# EAGLE design TVC-NanoSD-IO-2-1 (EAGLE 8.3.1)
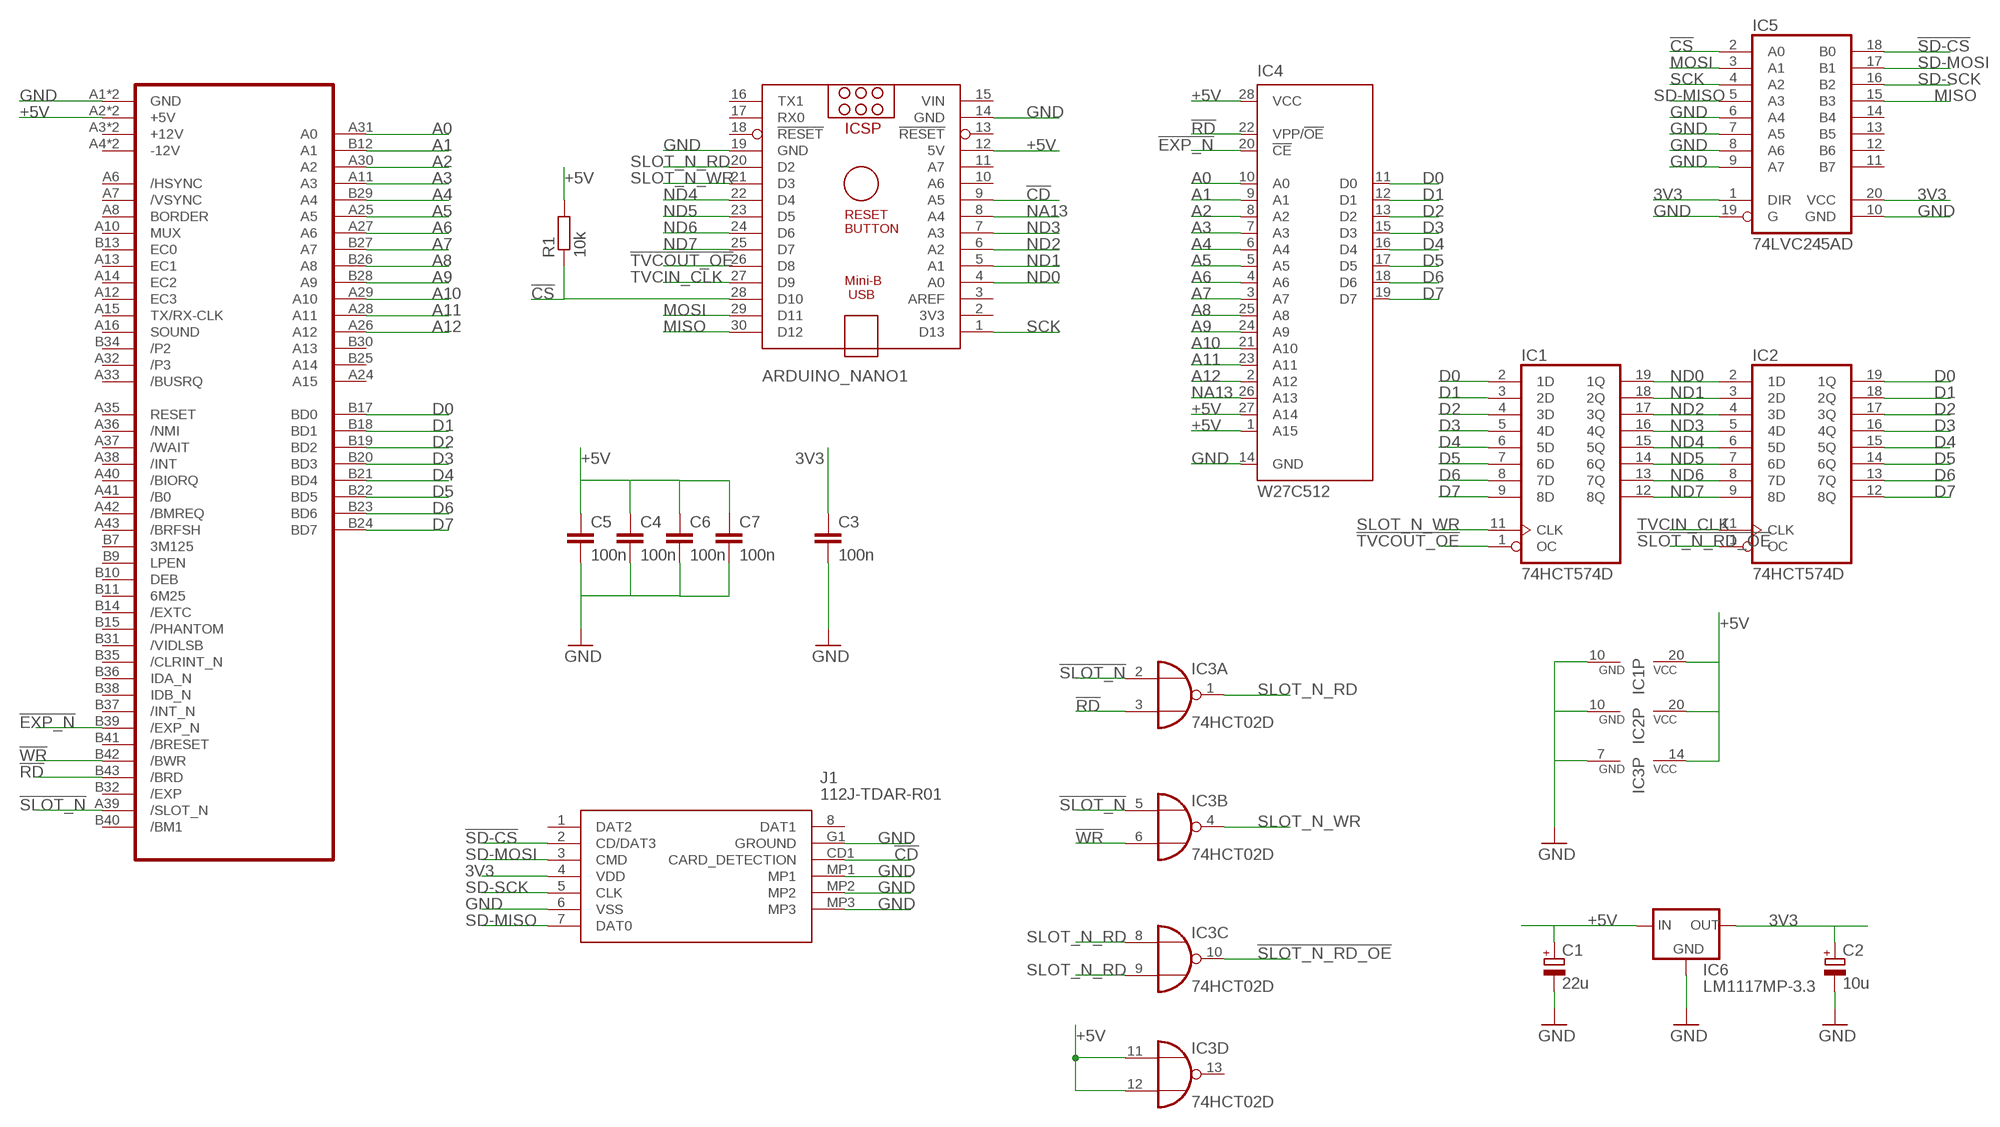
[diagram p0: schematic, sheet 1]

## Parts
ARDUINO_NANO1  ARDUINO_NANO  [ARDUINO_NANO]
C1  22u  CPOL-EUD  [PANASONIC_D]
C2  10u  CPOL_NANOSD  [PANASONIC_B]
C3  100n  C-EUC1206  [C1206]
C4  100n  C-EUC1206  [C1206]
C5  100n  C-EUC1206  [C1206]
C6  100n  C-EUC1206  [C1206]
C7  100n  C-EUC1206  [C1206]
CON1  TVC-EXP-HBA-COMMON  [TVC-EXP-EDGE]
IC1  74HCT574D  [SO20W]
IC2  74HCT574D  [SO20W]
IC3  74HCT02D  [SO14]
IC4  W27C512  [DIL28-6]
IC5  74LVC245AD  [SO20W]
IC6  LM1117MP-3.3  [SOT223]
J1  112J-TDAR-R01  [112JTDARR01]
R1  10k  R-EU_R1206  [R1206]

## Nets
3V3 [pwr]: C2.+ C3.1 IC5.1(DIR) IC5.20(VCC) IC6.2(OUT) IC6.4(OUT) J1.4(VDD)
!CD: ARDUINO_NANO1.9(A5) J1.CD1(CARD_DETECTION)
!CS: ARDUINO_NANO1.28(D10) IC5.2(A0) R1.1
!EXP_N: CON1.B39(/EXP_N) IC4.20(!CE)
!RD: CON1.B43(/BRD) IC3.3(A:I1) IC4.22(VPP/!OE)
!SD-CS: IC5.18(B0) J1.2(CD/DAT3)
!SLOT_N: CON1.A39(/SLOT_N) IC3.2(A:I0) IC3.5(B:I0)
!SLOT_N_RD_OE: IC2.1(OC) IC3.10(C:O)
!TVCOUT_OE: ARDUINO_NANO1.26(D8) IC1.1(OC)
!WR: CON1.B42(/BWR) IC3.6(B:I1)
+5V [pwr]: ARDUINO_NANO1.12(5V) C1.+ C4.1 C5.1 C6.1 C7.1 CON1.A2(+5V) CON1.B2(+5V) IC1.20(VCC) IC2.20(VCC) IC3.11(D:I0) IC3.12(D:I1) IC3.14(P:VCC) IC4.1(A15) IC4.27(A14) IC4.28(VCC) IC6.3(IN) R1.2
A0: CON1.A31(A0) IC4.10(A0)
A1: CON1.B12(A1) IC4.9(A1)
A2: CON1.A30(A2) IC4.8(A2)
A3: CON1.A11(A3) IC4.7(A3)
A4: CON1.B29(A4) IC4.6(A4)
A5: CON1.A25(A5) IC4.5(A5)
A6: CON1.A27(A6) IC4.4(A6)
A7: CON1.B27(A7) IC4.3(A7)
A8: CON1.B26(A8) IC4.25(A8)
A9: CON1.B28(A9) IC4.24(A9)
A10: CON1.A29(A10) IC4.21(A10)
A11: CON1.A28(A11) IC4.23(A11)
A12: CON1.A26(A12) IC4.2(A12)
D0: CON1.B17(BD0) IC1.2(1D) IC2.19(1Q) IC4.11(D0)
D1: CON1.B18(BD1) IC1.3(2D) IC2.18(2Q) IC4.12(D1)
D2: CON1.B19(BD2) IC1.4(3D) IC2.17(3Q) IC4.13(D2)
D3: CON1.B20(BD3) IC1.5(4D) IC2.16(4Q) IC4.15(D3)
D4: CON1.B21(BD4) IC1.6(5D) IC2.15(5Q) IC4.16(D4)
D5: CON1.B22(BD5) IC1.7(6D) IC2.14(6Q) IC4.17(D5)
D6: CON1.B23(BD6) IC1.8(7D) IC2.13(7Q) IC4.18(D6)
D7: CON1.B24(BD7) IC1.9(8D) IC2.12(8Q) IC4.19(D7)
GND [pwr]: ARDUINO_NANO1.14(GND) ARDUINO_NANO1.19(GND) C1.- C2.- C3.2 C4.2 C5.2 C6.2 C7.2 CON1.A1(GND) CON1.B1(GND) IC1.10(GND) IC2.10(GND) IC3.7(P:GND) IC4.14(GND) IC5.6(A4) IC5.7(A5) IC5.8(A6) IC5.9(A7) IC5.10(GND) IC5.19(G) IC6.1(GND) J1.6(VSS) J1.G1(GROUND) J1.MP1 J1.MP2 J1.MP3
MISO: ARDUINO_NANO1.30(D12) IC5.15(B3)
MOSI: ARDUINO_NANO1.29(D11) IC5.3(A1)
NA13: ARDUINO_NANO1.8(A4) IC4.26(A13)
ND0: ARDUINO_NANO1.4(A0) IC1.19(1Q) IC2.2(1D)
ND1: ARDUINO_NANO1.5(A1) IC1.18(2Q) IC2.3(2D)
ND2: ARDUINO_NANO1.6(A2) IC1.17(3Q) IC2.4(3D)
ND3: ARDUINO_NANO1.7(A3) IC1.16(4Q) IC2.5(4D)
ND4: ARDUINO_NANO1.22(D4) IC1.15(5Q) IC2.6(5D)
ND5: ARDUINO_NANO1.23(D5) IC1.14(6Q) IC2.7(6D)
ND6: ARDUINO_NANO1.24(D6) IC1.13(7Q) IC2.8(7D)
ND7: ARDUINO_NANO1.25(D7) IC1.12(8Q) IC2.9(8D)
SCK: ARDUINO_NANO1.1(D13) IC5.4(A2)
SD-MISO: IC5.5(A3) J1.7(DAT0)
SD-MOSI: IC5.17(B1) J1.3(CMD)
SD-SCK: IC5.16(B2) J1.5(CLK)
SLOT_N_RD: ARDUINO_NANO1.20(D2) IC3.1(A:O) IC3.8(C:I0) IC3.9(C:I1)
SLOT_N_WR: ARDUINO_NANO1.21(D3) IC1.11(CLK) IC3.4(B:O)
TVCIN_CLK: ARDUINO_NANO1.27(D9) IC2.11(CLK)
Unconnected: ARDUINO_NANO1.2(3V3) ARDUINO_NANO1.3(AREF) ARDUINO_NANO1.10(A6) ARDUINO_NANO1.11(A7) ARDUINO_NANO1.13(!RESET) ARDUINO_NANO1.16(TX1) ARDUINO_NANO1.17(RX0) ARDUINO_NANO1.18(!RESET) CON1.A3(+12V) CON1.A4(-12V) CON1.A6(/HSYNC) CON1.A7(/VSYNC) CON1.A8(BORDER) CON1.A10(MUX) CON1.A12(EC3) CON1.A13(EC1) CON1.A14(EC2) CON1.A15(TX/RX-CLK) CON1.A16(SOUND) CON1.A24(A15) CON1.A32(/P3) CON1.A33(/BUSRQ) CON1.A35(RESET) CON1.A36(/NMI) CON1.A37(/WAIT) CON1.A38(/INT) CON1.A40(/BIORQ) CON1.A41(/B0) CON1.A42(/BMREQ) CON1.A43(/BRFSH) CON1.B3(+12V) CON1.B4(-12V) CON1.B7(3M125) CON1.B9(LPEN) CON1.B10(DEB) CON1.B11(6M25) CON1.B13(EC0) CON1.B14(/EXTC) CON1.B15(/PHANTOM) CON1.B25(A14) CON1.B30(A13) CON1.B31(/VIDLSB) CON1.B32(/EXP) CON1.B34(/P2) CON1.B35(/CLRINT_N) CON1.B36(IDA_N) CON1.B37(/INT_N) CON1.B38(IDB_N) CON1.B40(/BM1) CON1.B41(/BRESET) IC3.13(D:O) IC5.11(B7) IC5.12(B6) IC5.13(B5) IC5.14(B4) J1.1(DAT2) J1.8(DAT1)

## Power pins joined to a net without a drawn wire
VIN: ARDUINO_NANO1.15(VIN)

## Library data of the parts
ARDUINO_NANO1 = ArduinoNanoV30:ARDUINO_NANO: Arduino Nano V3.0 Overview: The Arduino Nano is a small, complete, and breadboard-friendly board based on the ATmega328 (Arduino Nano 3.x) or ATmega168 (Arduino Nano 2.x). It has more or less the same functionality of the Arduino Duemilanove, but in a different package. It lacks only a DC power jack, and works with a Mini-B USB cable instead of a standard one. The Nano was designed and is being produced by Gravitech. Specifications: Microcontroller Atmel ATmega168 or ATmega328 Operating Voltage (logic level) 5 V Input Voltage (recommended) 7-12 V Input Voltage (limits) 6-20 V Digital I/O Pins 14 (of which 6 provide PWM output) Analog Input Pins 8 DC Current per I/O Pin 40 mA Flash Memory 16 KB (ATmega168) or 32 KB (ATmega328) of which 2 KB used by bootloader SRAM 1 KB (ATmega168) or 2 KB (ATmega328) EEPROM 512 bytes (ATmega168) or 1 KB (ATmega328) Clock Speed 16 MHz Dimensions 0.73" x 1.70" Length 45 mm Width 18 mm Weigth 5 g Power: The Arduino Nano can be powered via the Mini-B USB connection, 6-20V unregulated external power supply (pin 30), or 5V regulated external power supply (pin 27). The power source is automatically selected to the highest voltage source. Memory: The ATmega168 has 16 KB of flash memory for storing code (of which 2 KB is used for the bootloader); the ATmega328 has 32 KB, (also with 2 KB used for the bootloader). The ATmega168 has 1 KB of SRAM and 512 bytes of EEPROM (which can be read and written with the EEPROM library); the ATmega328 has 2 KB of SRAM and 1 KB of EEPROM. Input and Output: Each of the 14 digital pins on the Nano can be used as an input or output, using pinMode(), digitalWrite(), and digitalRead() functions. They operate at 5 volts. Each pin can provide or receive a maximum of 40 mA and has an internal pull-up resistor (disconnected by default) of 20-50 kOhms. In addition, some pins have specialized functions. Visit Arduino - ArduinoBoardNano <https://www.arduino.cc/en/Main/ArduinoBoardNano>
C1 = rcl:CPOL-EU: POLARIZED CAPACITOR, European symbol
C2 = NanoCPOL:CPOL_NANOSD
C3-C7 = rcl:C-EU: CAPACITOR, European symbol
CON1 = tvc-exp:TVC-EXP-HBA-COMMON: Videoton TV-Computer expansion port edge connector, common pins for 32k, 64k and 64k+
IC1 IC2 = 74xx-eu:74*574: 8-bit D type FLIP FLOP bus driver
IC3 = 74xx-eu:74*02: Quad 2-input NOR gate
IC4 = Winbond:W27C512
IC5 = NXP:74LVC245AD
IC6 = lm1117_10:LM1117?-*: 800mA Low-Dropout Linear Regulator Source: http://www.ti.com/lit/ds/symlink/lm1117-n.pdf; MF: Texas Instruments; MPN: LM1117MP-3.3; OC_FARNELL: 9778195; OC_NEWARK: 28X3416
J1 = 112J-TDAR-R01:112J-TDAR-R01: Connector: for cards; SD Micro; push-push; SMT; gold-plated Source: Datasheet <https://cdn.sos.sk/productdata/2c/8b/de324bd3/112j-tdar-r01.pdf>; DESCRIPTION: Connector: for cards; SD Micro; push-push; SMT; gold-plated; HEIGHT: 2mm; MANUFACTURER_NAME: ATTEND; MANUFACTURER_PART_NUMBER: 112J-TDAR-R01
R1 = rcl:R-EU_: RESISTOR, European symbol

## Net classes
1 pwr: width 0.508 mm

## Board
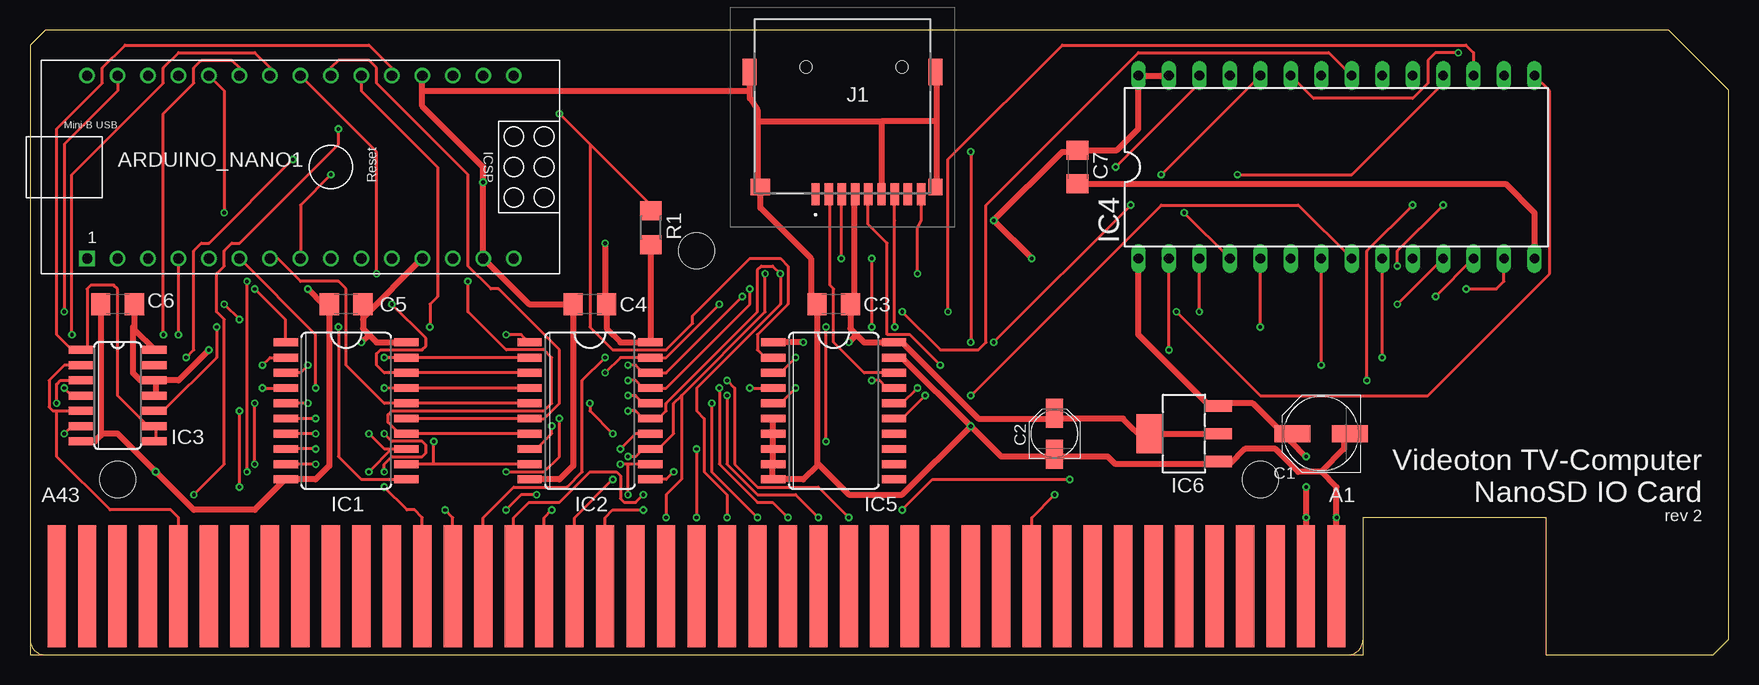
[diagram p1: board, top side]
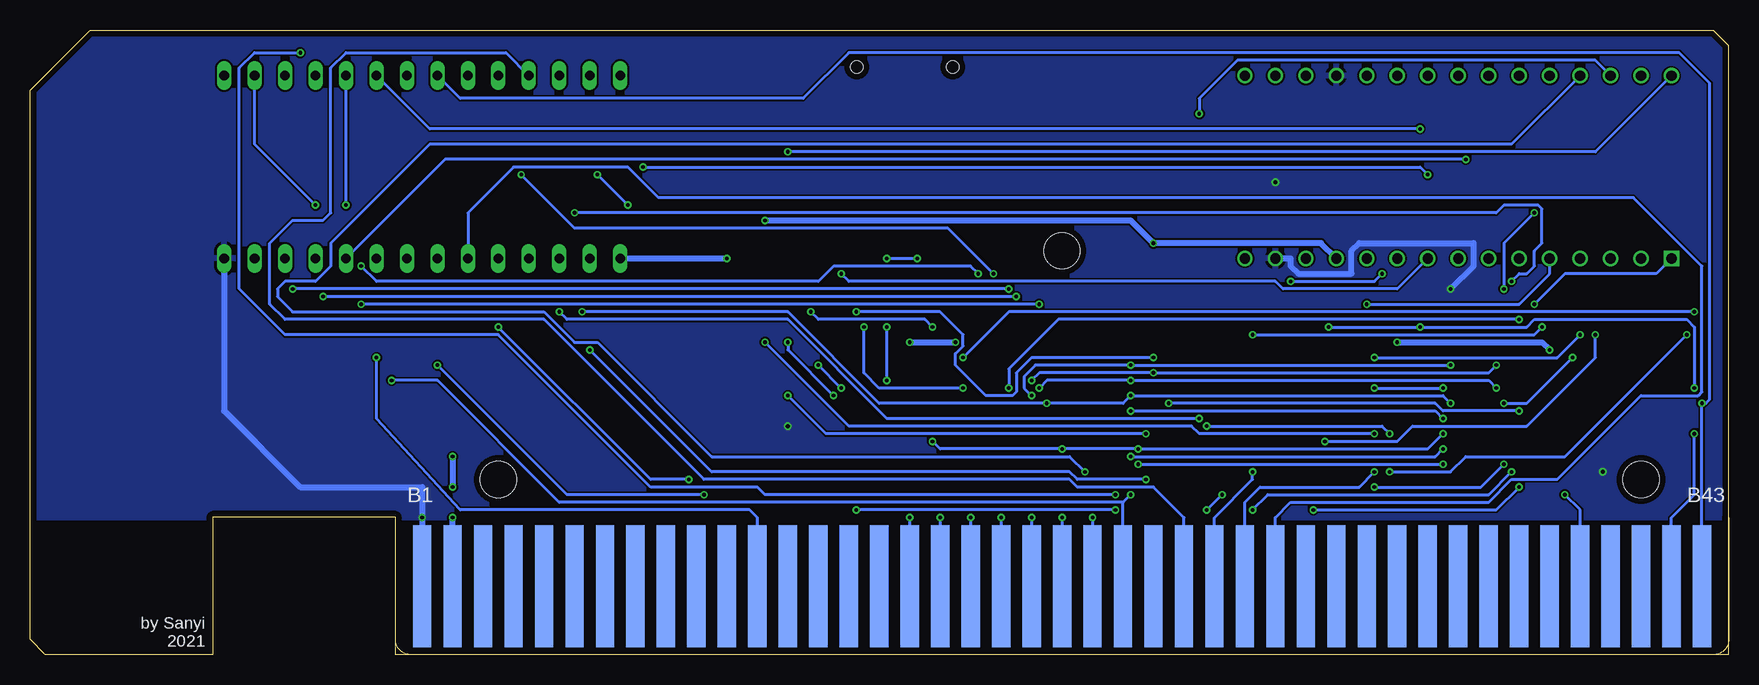
[diagram p2: board, bottom side, seen from below]

Size 141.59 x 52.06 mm. Coordinates in mm from the lower left corner, seen from the top.
Outline: 0.01,0 111.13,0 111.13,11.44 126.36,11.44 126.36,0 140.32,0 141.59,1.27 141.59,47.06 136.59,52.06 1.28,52.06 0.01,50.79 0.01,0
Copper layers (1*16): Top 0.035mm / dielectric 1.6mm / Bottom 0.035mm
Design rules "Elecrow_2-layer_PCB_eagle_rule *": minimum track width 10mil, minimum drill 12mil, track to track 6mil, track to pad 6mil, pad to pad 6mil, via to via 8mil, smd to smd 0mil, copper to edge 20mil, drill to drill 10mil, minimum pad ring 6mil, minimum via ring 6mil, stop-mask expansion 0mil, vias tented up to drill 100mil, thermal gap 10mil
Holes 3 mm at 55.56,33.66 7.3,14.61 102.55,14.61

### Footprints (pad centres in the part's own frame; a part is rotated, then mirrored left to right if it is on the bottom)
ARDUINO_NANO = drill 0.85 square: 1 -20.32,-7.62 | drill 0.85: 2 -17.78,-7.62; 3 -15.24,-7.62; 4 -12.7,-7.62; 5 -10.16,-7.62; 6 -7.62,-7.62; 7 -5.08,-7.62; 8 -2.54,-7.62; 9 0,-7.62; 10 2.54,-7.62; 11 5.08,-7.62; 12 7.62,-7.62; 13 10.16,-7.62; 14 12.7,-7.62; 15 15.24,-7.62; 16 15.24,7.62; 17 12.7,7.62; 18 10.16,7.62; 19 7.62,7.62; 20 5.08,7.62; 21 2.54,7.62; 22 0,7.62; 23 -2.54,7.62; 24 -5.08,7.62; 25 -7.62,7.62; 26 -10.16,7.62; 27 -12.7,7.62; 28 -15.24,7.62; 29 -17.78,7.62; 30 -20.32,7.62
PANASONIC_D = smd 3 x 1.4: + 2.4,0; - -2.4,0
PANASONIC_B = smd 2.4 x 1.4: + 1.7,0; - -1.7,0
C1206 = smd 1.6 x 1.8: 1 -1.4,0; 2 1.4,0
TVC-EXP-EDGE = smd 1.524 x 10.16: A1 53.34,-5.715; A2 50.8,-5.715; A3 48.26,-5.715; A4 45.72,-5.715; A5 43.18,-5.715; A6 40.64,-5.715; A7 38.1,-5.715; A8 35.56,-5.715; A9 33.02,-5.715; A10 30.48,-5.715; A11 27.94,-5.715; A12 25.4,-5.715; A13 22.86,-5.715; A14 20.32,-5.715; A15 17.78,-5.715; A16 15.24,-5.715; A17 12.7,-5.715; A18 10.16,-5.715; A19 7.62,-5.715; A20 5.08,-5.715; A21 2.54,-5.715; A22 0,-5.715; A23 -2.54,-5.715; A24 -5.08,-5.715; A25 -7.62,-5.715; A26 -10.16,-5.715; A27 -12.7,-5.715; A28 -15.24,-5.715; A29 -17.78,-5.715; A30 -20.32,-5.715; A31 -22.86,-5.715; A32 -25.4,-5.715; A33 -27.94,-5.715; A34 -30.48,-5.715; A35 -33.02,-5.715; A36 -35.56,-5.715; A37 -38.1,-5.715; A38 -40.64,-5.715; A39 -43.18,-5.715; A40 -45.72,-5.715; A41 -48.26,-5.715; A42 -50.8,-5.715; A43 -53.34,-5.715 | smd 1.524 x 10.16 bottom: B1 53.34,-5.715; B2 50.8,-5.715; B3 48.26,-5.715; B4 45.72,-5.715; B5 43.18,-5.715; B6 40.64,-5.715; B7 38.1,-5.715; B8 35.56,-5.715; B9 33.02,-5.715; B10 30.48,-5.715; B11 27.94,-5.715; B12 25.4,-5.715; B13 22.86,-5.715; B14 20.32,-5.715; B15 17.78,-5.715; B16 15.24,-5.715; B17 12.7,-5.715; B18 10.16,-5.715; B19 7.62,-5.715; B20 5.08,-5.715; B21 2.54,-5.715; B22 0,-5.715; B23 -2.54,-5.715; B24 -5.08,-5.715; B25 -7.62,-5.715; B26 -10.16,-5.715; B27 -12.7,-5.715; B28 -15.24,-5.715; B29 -17.78,-5.715; B30 -20.32,-5.715; B31 -22.86,-5.715; B32 -25.4,-5.715; B33 -27.94,-5.715; B34 -30.48,-5.715; B35 -33.02,-5.715; B36 -35.56,-5.715; B37 -38.1,-5.715; B38 -40.64,-5.715; B39 -43.18,-5.715; B40 -45.72,-5.715; B41 -48.26,-5.715; B42 -50.8,-5.715; B43 -53.34,-5.715
SO20W = smd 0.66 x 2.032: 1 -5.715,-5.029; 2 -4.445,-5.029; 3 -3.175,-5.029; 4 -1.905,-5.029; 5 -0.635,-5.029; 6 0.635,-5.029; 7 1.905,-5.029; 8 3.175,-5.029; 9 4.445,-5.029; 10 5.715,-5.029; 11 5.715,5.029; 12 4.445,5.029; 13 3.175,5.029; 14 1.905,5.029; 15 0.635,5.029; 16 -0.635,5.029; 17 -1.905,5.029; 18 -3.175,5.029; 19 -4.445,5.029; 20 -5.715,5.029
SO14 = smd 0.66 x 2.032: 1 -3.81,-3.073; 2 -2.54,-3.073; 3 -1.27,-3.073; 4 0,-3.073; 5 1.27,-3.073; 6 2.54,-3.073; 7 3.81,-3.073; 8 3.81,3.073; 9 2.54,3.073; 10 1.27,3.073; 11 0,3.073; 12 -1.27,3.073; 13 -2.54,3.073; 14 -3.81,3.073
DIL28-6 = drill 0.813 long: 1 -16.51,-7.62; 2 -13.97,-7.62; 3 -11.43,-7.62; 4 -8.89,-7.62; 5 -6.35,-7.62; 6 -3.81,-7.62; 7 -1.27,-7.62; 8 1.27,-7.62; 9 3.81,-7.62; 10 6.35,-7.62; 11 8.89,-7.62; 12 11.43,-7.62; 13 13.97,-7.62; 14 16.51,-7.62; 15 16.51,7.62; 16 13.97,7.62; 17 11.43,7.62; 18 8.89,7.62; 19 6.35,7.62; 20 3.81,7.62; 21 1.27,7.62; 22 -1.27,7.62; 23 -3.81,7.62; 24 -6.35,7.62; 25 -8.89,7.62; 26 -11.43,7.62; 27 -13.97,7.62; 28 -16.51,7.62
SOT223 = smd 0.95 x 2.15: 1 -2.3,-2.9; 2 0,-2.9; 3 2.3,-2.9 | smd 3.25 x 2.15: 4 0,2.9
112JTDARR01 = smd 0.7 x 1.8: 1 2.25,7.35; 2 1.15,7.35; 3 0.05,7.35; 4 -1.05,7.35; 5 -2.15,7.35; 6 -3.25,7.35; 7 -4.35,7.35; 8 -5.45,7.35; CD1 -6.55,7.35 | smd 1.2 x 1.4: G1 -7.75,6.75 | smd 1.6 x 1.4: MP1 6.85,6.75 | smd 1.2 x 2.2: MP2 7.75,-2.85; MP3 -7.75,-2.85 | hole 1: 3.05,-3.25; -4.95,-3.25
R1206 = smd 1.6 x 1.803: 1 -1.422,0; 2 1.422,0

### Placement (x,y rotation side)
ARDUINO_NANO1  25.08,40.64 0 top
C1  107.63,18.41 180 top
C2  85.41,18.41 90 top
C3  66.99,29.21 180 top
C4  46.67,29.21 180 top
C5  26.35,29.21 180 top
C6  7.3,29.21 180 top
C7  87.31,40.64 270 top
CON1  55.56,11.43 0 top
IC1  26.35,20.32 270 top
IC2  46.67,20.32 270 top
IC3  7.3,21.59 270 top
IC4  108.9,40.64 0 top
IC5  66.99,20.32 270 top
IC6  96.2,18.41 90 top
J1  67.73,45.72 180 top
R1  51.75,35.59 270 top

### Tracks (layer width: path | path; a pad name or v marks a point on that pad's centre or on a via)
3V3  (via drill 0.3)
  Top 0.508: 68.9,26.67 68.39,27.18 C3.1 68.9,29.21 68.9,29.37 68.74,29.53 68.74,37.78 J1.4 | 68.9,26.67 69.53,26.04 IC5.20 72.71,26.04 79.06,19.68 85.41,19.68 | IC6.2 IC6.4 93.03,17.78 91.12,19.68 85.41,19.68 | v64.45,26.04 IC5.1 | 68.9,26.67 v68.26,26.04 | 85.41,19.68 C2.+
  Bottom 0.508: v68.26,26.04 v64.45,26.04
!CD  (via drill 0.3)
  Top 0.254: v73.98,31.75 73.98,35.56 74.29,36.2 74.29,37.78 74.28,37.8 J1.CD1
  Bottom 0.254: v73.98,31.75 73.34,31.11 37.78,31.11 37.15,30.48 27.62,30.48 ARDUINO_NANO1.9
!CS  (via drill 0.3)
  Top 0.254: v44.13,45.09 46.67,42.55 | 46.67,42.55 51.75,37.47 R1.1 | IC5.2 61.28,24.77 60.64,25.4 60.64,26.67 63.18,29.21 63.18,32.38 62.55,33.02 60.01,33.02 55.24,28.26 55.24,27.62 53.02,25.4 48.58,25.4 46.67,27.3 46.67,42.55
  Bottom 0.254: v44.13,45.09 44.13,46.35 40.96,49.53 11.11,49.53 ARDUINO_NANO1.28
!EXP_N  (via drill 0.3)
  Top 0.254: v25.72,43.81 25.72,42.55 17.46,34.29 16.83,34.29 16.19,33.66 16.19,32.38 15.56,31.75 15.56,28.57 16.19,27.94 16.19,15.88 v13.65,13.34
  Bottom 0.254: IC4.20 108.27,43.81 v25.72,43.81 | v13.65,13.34 12.38,12.06 CON1.B39
!RD  (via drill 0.3)
  Top 0.254: v2.22,20.95 2.22,22.54 2.54,22.86 IC3.3
  Bottom 0.254: CON1.B43 v2.22,20.95 1.91,20.95 1.59,21.27 1.59,47.62 4.13,50.16 73.34,50.16 77.15,46.35 105.73,46.35 IC4.22
!SD-CS
  Top 0.254: IC5.18 69.53,23.5 66.99,26.04 66.99,30.48 66.68,30.8 66.68,36.51 66.68,37.78 J1.2
!SLOT_N
  Top 0.254: 2.22,20.32 1.91,20.32 1.59,20.64 1.59,22.86 2.86,24.13 IC3.2 | 2.22,20.32 IC3.5 | 2.22,20.32 2.22,16.51 6.67,12.06 11.75,12.06 12.38,11.43 CON1.A39
!SLOT_N_RD_OE  (via drill 0.3)
  Top 0.254: IC3.10 11.11,20.32 15.56,24.77 v15.56,27.3 | v39.69,26.67 40.96,26.67 41.59,26.04 IC2.1
  Bottom 0.254: v15.56,27.3 16.19,26.67 v39.69,26.67
!TVCOUT_OE  (via drill 0.3)
  Top 0.254: v18.73,30.48 21.27,27.94 21.27,26.04 IC1.1 | v16.19,36.83 16.19,46.99 ARDUINO_NANO1.26
  Bottom 0.254: v16.19,36.83 18.73,34.29 v18.73,30.48
!WR  (via drill 0.3)
  Top 0.254: IC3.6 3.49,19.05 v2.86,18.41
  Bottom 0.254: v2.86,18.41 2.86,13.34 4.13,12.06 4.76,11.43 CON1.B42
+5V  (via drill 0.3)
  Top 0.508: C6.1 8.7,27.3 | 8.7,27.3 8.7,27.07 IC3.14 | C5.1 27.75,27.94 | 27.75,27.94 27.75,27.18 28.26,26.67 | 28.26,26.67 28.89,26.04 IC1.20 | R1.2 51.75,26.04 IC2.20 49.21,26.04 48.07,27.18 C4.1 47.94,29.21 v47.94,34.29 | 10.48,22.86 10.48,21.59 IC3.11 | 8.7,27.3 8.57,27.3 8.57,23.5 9.21,22.86 IC3.12 10.48,22.86 | ARDUINO_NANO1.12 27.78,28.1 27.75,27.94 | 10.48,22.86 12.38,22.86 v14.92,25.4 | 28.26,26.67 v27.62,26.04 | CON1.B2 v106.36,11.43 v106.36,13.97 | IC4.27 IC4.28 92.39,43.81 90.62,42.04 C7.1 87.31,41.91 86.04,41.91 v80.33,36.2 v83.5,33.02 | 105.09,17.78 101.92,20.95 100.01,20.95 IC6.3 98.11,20.95 92.39,26.67 IC4.1 | 105.09,17.78 v106.36,16.51 | 105.09,17.78 C1.+
  Bottom 0.508: v14.92,25.4 15.56,26.04 v27.62,26.04 | ARDUINO_NANO1.12 33.97,34.29 v47.94,34.29 49.85,36.2 v80.33,36.2 | CON1.B2 v106.36,11.43 | IC4.1 v83.5,33.02 | v106.36,16.51 v106.36,13.97
A0  (via drill 0.3)
  Top 0.254: v21.91,41.27 14.92,34.29 14.29,34.29 13.65,33.66 13.65,25.4 v13.02,24.77 | v18.73,15.88 v18.73,20.95 | v29.53,13.97 31.43,12.06 32.07,12.06 32.7,11.43 CON1.A31
  Bottom 0.254: IC4.10 107,41.27 v21.91,41.27 | v13.02,24.77 16.83,20.95 v18.73,20.95 | v18.73,15.88 20.64,13.97 v29.53,13.97
A1  (via drill 0.3)
  Top 0.254: v112.71,24.77 IC4.9
  Bottom 0.254: v112.71,24.77 112.71,19.68 105.73,12.06 81.6,12.06 80.96,11.43 CON1.B12
A2  (via drill 0.3)
  Top 0.254: IC4.8 105.73,37.47 94.3,37.47 v78.42,21.59 | v48.58,18.41 46.67,20.32 v46.67,20.95 | v17.46,13.97 v17.46,20.32 | v34.61,12.06 35.24,11.43 CON1.A30
  Bottom 0.254: v78.42,21.59 75.25,18.41 v48.58,18.41 | v46.67,20.95 24.45,20.95 23.81,20.32 v17.46,20.32 | v17.46,13.97 19.37,12.06 v34.61,12.06
A3  (via drill 0.3)
  Top 0.254: v107.63,24.13 IC4.7 | v85.41,13.34 83.5,11.43 CON1.A11
  Bottom 0.254: v107.63,24.13 96.84,13.34 v85.41,13.34
A4
  Bottom 0.254: IC4.6 105.09,36.83 101.28,40.64 91.76,40.64 89.22,38.1 7.94,38.1 2.22,32.38 2.22,21.91 2.54,21.59 7.3,21.59 14.29,14.61 18.1,14.61 20,12.7 36.51,12.7 37.78,11.43 CON1.B29
A5  (via drill 0.3)
  Top 0.254: v102.55,27.3 IC4.5 | v86.68,14.61 75.25,14.61 v72.71,12.06 | v51.12,12.06 48.58,12.06 47.94,11.43 CON1.A25
  Bottom 0.254: v102.55,27.3 89.85,14.61 v86.68,14.61 | v51.12,12.06 v72.71,12.06
A6  (via drill 0.3)
  Top 0.254: v96.2,36.83 IC4.4 | v18.1,15.24 v18.1,31.11 | v39.69,12.06 40.96,13.34 v42.23,13.34 | v43.5,12.06 42.86,11.43 CON1.A27
  Bottom 0.254: v96.2,36.83 19.37,36.83 18.73,37.47 15.87,37.47 15.56,37.15 15.56,34.29 16.19,33.66 16.19,32.38 16.83,31.75 17.46,31.75 v18.1,31.11 | v18.1,15.24 20,13.34 38.42,13.34 v39.69,12.06 | v43.5,12.06 v42.23,13.34
A7  (via drill 0.3)
  Top 0.254: v97.47,28.57 IC4.3 | v44.13,19.68 44.13,16.51 42.86,15.24 v39.69,15.24
  Bottom 0.254: v97.47,28.57 96.84,27.94 78.42,27.94 70.17,19.68 v44.13,19.68 | v39.69,15.24 39.69,14.61 42.86,11.43 CON1.B27
A8
  Bottom 0.254: IC4.25 101.92,50.16 115.25,50.16 116.52,48.9 116.52,36.83 117.16,36.2 119.7,36.2 121.6,34.29 121.6,29.21 120.33,27.94 98.74,27.94 85.41,14.61 54.93,14.61 54.29,13.97 47.94,13.97 45.4,11.43 CON1.B26
A9  (via drill 0.3)
  Top 0.254: v94.3,40.01 IC4.24 | v80.33,26.04 v91.76,37.47 | v29.53,18.41 30.16,17.78 32.7,17.78 33.02,17.46 33.02,16.83 32.7,16.51 30.16,16.51 29.53,15.88 v29.53,15.24
  Bottom 0.254: v91.76,37.47 v94.3,40.01 | v80.33,26.04 73.34,19.05 44.77,19.05 44.13,18.41 v29.53,18.41 | v29.53,15.24 30.8,13.97 39.05,13.97 40.32,12.7 CON1.B28
A10  (via drill 0.3)
  Top 0.254: IC4.21 108.27,50.16 92.39,50.16 79.69,37.47 79.69,26.04 79.06,25.4 75.88,25.4 v72.71,28.57 | v47.94,24.77 46.04,22.86 46.04,15.24 44.77,13.97 40.32,13.97 37.78,11.43 CON1.A29
  Bottom 0.254: v72.71,28.57 65.72,28.57 63.82,26.67 63.82,25.72 64.45,25.08 64.45,24.13 61.91,21.59 59.69,21.59 59.37,21.91 59.37,23.5 58.1,24.77 v47.94,24.77
A11  (via drill 0.3)
  Top 0.254: IC4.23 107,46.35 115.25,46.35 116.52,47.62 116.52,49.53 117.16,50.16 v119.06,50.16 | v51.12,13.34 50.48,12.7 49.53,12.7 49.21,13.02 49.21,14.92 48.89,15.24 46.67,15.24 44.13,12.7 41.59,12.7 40.32,11.43 CON1.A28
  Bottom 0.254: v119.06,50.16 122.87,50.16 124.14,48.9 124.14,30.48 120.33,26.67 102.55,26.67 89.85,13.97 80.96,13.97 80.33,13.34 v51.12,13.34
A12  (via drill 0.3)
  Top 0.254: v94.93,25.4 IC4.2 | v48.58,14.61 45.4,11.43 CON1.A26
  Bottom 0.254: v94.93,25.4 84.77,15.24 54.93,15.24 54.29,14.61 v48.58,14.61
D0  (via drill 0.3)
  Top 0.254: IC1.2 20,24.77 v19.37,24.13 | v47.94,23.5 49.21,24.77 IC2.19 53.02,24.77 v57.47,29.21 | v113.98,29.21 IC4.11 | v68.26,11.43 65.72,13.97 60.64,13.97 58.74,15.88 58.74,22.23 v58.1,22.86
  Bottom 0.254: v19.37,24.13 20,23.5 v47.94,23.5 57.47,23.5 v58.1,22.86 | v57.47,29.21 v113.98,29.21 | v68.26,11.43 CON1.B17
D1  (via drill 0.3)
  Top 0.254: IC1.3 22.54,23.5 v23.18,24.13 | v49.85,24.13 50.48,24.13 51.12,23.5 IC2.18 53.02,23.5 v59.37,29.84 | v117.16,29.84 IC4.12 | v65.72,11.43 63.82,13.34 60.64,13.34 58.1,15.88 v58.1,21.59
  Bottom 0.254: v23.18,24.13 v49.85,24.13 57.78,24.13 58.74,23.18 58.74,22.23 v58.1,21.59 | v59.37,29.84 v117.16,29.84 | v65.72,11.43 CON1.B18
D2  (via drill 0.3)
  Top 0.254: v19.37,22.23 IC1.4 | v49.85,22.86 50.48,22.86 51.12,22.23 IC2.17 53.02,22.23 60.01,29.21 v60.01,30.48 | v119.7,30.48 122.24,30.48 122.87,31.11 IC4.13 | v63.18,11.43 61.91,12.7 60.64,12.7 57.47,15.88 v57.47,22.23
  Bottom 0.254: v19.37,22.23 20,22.86 v49.85,22.86 56.83,22.86 v57.47,22.23 | v60.01,30.48 v119.7,30.48 | v63.18,11.43 CON1.B19
D3  (via drill 0.3)
  Top 0.254: v23.18,20.95 IC1.5 | v49.85,21.59 50.48,21.59 51.12,20.95 IC2.16 | IC4.15 126.68,46.99 126.68,31.75 116.52,21.59 102.55,21.59 v95.57,28.57 | v60.64,11.43 56.83,15.24 v56.83,20.95
  Bottom 0.254: v23.18,20.95 23.81,21.59 v49.85,21.59 50.48,20.95 v56.83,20.95 70.8,20.95 78.42,28.57 v95.57,28.57 | v60.64,11.43 CON1.B20
D4  (via drill 0.3)
  Top 0.254: v23.81,19.68 IC1.6 | v49.85,20.32 50.48,20.32 51.12,19.68 IC2.15 52.39,19.68 53.02,20.32 53.02,20.95 60.64,28.57 60.64,32.07 60.96,32.38 61.91,32.38 v62.55,31.75 62.55,29.21 55.56,22.23 55.56,20.32 56.2,19.68 56.2,15.24 58.1,13.34 v58.1,11.43 | v117.79,37.47 113.98,33.66 v113.98,32.38
  Bottom 0.254: v23.81,19.68 24.45,20.32 v49.85,20.32 | v117.79,37.47 122.87,42.55 IC4.16 | v113.98,32.38 112.71,31.11 75.88,31.11 74.61,32.38 63.18,32.38 v62.55,31.75 | v58.1,11.43 CON1.B21
D5  (via drill 0.3)
  Top 0.254: v23.81,18.41 IC1.7 | v49.21,17.14 50.48,18.41 IC2.14 | IC4.17 120.33,50.16 119.7,50.8 86.04,50.8 76.52,41.27 v76.52,28.57 | v66.36,17.78 v66.36,27.3 | v55.56,17.14 v55.56,11.43
  Bottom 0.254: v23.81,18.41 25.08,17.14 v49.21,17.14 v55.56,17.14 65.72,17.14 v66.36,17.78 | v76.52,28.57 75.88,27.94 66.99,27.94 v66.36,27.3 | v55.56,11.43 CON1.B22
D6  (via drill 0.3)
  Top 0.254: v23.81,17.14 IC1.8 | v49.85,16.51 50.48,16.51 51.12,17.14 IC2.13 52.39,17.14 53.66,18.41 53.66,20.95 54.29,21.59 | IC4.18 117.79,47.62 110.17,40.01 v100.65,40.01 | v61.28,31.75 61.28,28.57 54.29,21.59 | v53.02,11.43 53.02,13.34 54.29,14.61 54.29,21.59
  Bottom 0.254: v23.81,17.14 24.45,16.51 v49.85,16.51 | v100.65,40.01 96.2,35.56 65.09,35.56 v61.28,31.75 | v53.02,11.43 CON1.B23
D7  (via drill 0.3)
  Top 0.254: v23.81,15.88 IC1.9 | IC2.12 49.85,15.88 | 49.85,15.88 v49.21,15.88 | v115.25,37.47 111.44,33.66 v111.44,22.86 | v49.85,13.34 49.85,15.88
  Bottom 0.254: v49.21,15.88 v23.81,15.88 | v115.25,37.47 IC4.19 | v111.44,22.86 107.63,22.86 97.47,12.7 50.48,12.7 | CON1.B24 50.48,12.7 | 50.48,12.7 v49.85,13.34
GND  (via drill 0.3, 0.35)
  Top 0.508: C6.2 5.9,18.29 | 5.9,18.29 5.4,17.78 IC3.7 | IC2.10 44.13,14.61 45.27,15.74 C4.2 41.59,29.21 ARDUINO_NANO1.14 v37.78,39.37 37.78,40.64 32.7,45.72 32.7,46.99 | 65.59,15.74 C3.2 65.09,29.21 65.09,33.02 60.88,37.23 J1.MP1 60.88,39.13 60.64,39.37 60.64,44.45 | 65.59,15.74 64.45,14.61 IC5.10 61.91,14.61 61.91,15.88 | C7.2 123,39.24 125.41,36.83 IC4.14 | IC5.19 72.71,24.77 v78.42,19.05 | v78.42,19.05 80.96,16.51 85.41,16.51 | 107.63,15.24 105.73,15.24 103.82,17.14 101.28,17.14 100.01,15.88 99.7,16.19 IC6.1 98.11,15.88 90.49,15.88 89.85,16.51 85.41,16.51 | 107.63,15.24 109.54,17.14 109.54,17.78 C1.- | 107.63,15.24 108.9,13.97 v108.9,11.43 CON1.B1 | 85.41,16.51 C2.- | 75.56,44.45 75.56,47.94 J1.MP3 | 75.56,44.45 75.56,38.73 J1.G1 | 70.96,44.45 70.96,37.94 J1.6 | 75.56,44.45 70.96,44.45 | 61.91,17.14 61.91,15.88 | 61.91,15.88 IC5.9 | 61.91,18.41 61.91,19.68 IC5.6 | 61.91,18.41 61.91,17.14 | 61.91,17.14 IC5.8 | 61.91,18.41 IC5.7 | 60.64,44.45 60.64,45.4 60.01,46.35 J1.MP2 60.01,46.99 32.7,46.99 | 60.64,44.45 70.96,44.45 | 5.9,18.29 6.03,18.41 7.3,18.41 v10.48,15.24 13.65,12.06 18.73,12.06 21.27,14.61 IC1.10 23.81,14.61 24.95,15.74 C5.2 24.45,29.21 v23.18,30.48 | 32.7,46.99 ARDUINO_NANO1.19 | v78.42,19.05 72.71,13.34 68.26,13.34 65.72,15.88 65.59,15.74
  Bottom 0.508: CON1.B1 v108.9,11.43 108.9,13.97 119.06,13.97 125.41,20.32 IC4.14 | v23.18,30.48 21.27,32.38 21.27,34.29 30.8,34.29 31.43,33.66 31.43,31.75 35.88,31.75 36.51,32.38 36.51,33.02 ARDUINO_NANO1.14
  pour Bottom: -0.32,52.07 -0.32,11.43 141.92,11.43 141.92,46.99 135.57,53.34 0.95,53.34
MISO  (via drill 0.3)
  Top 0.254: IC5.15 72.71,19.68 v74.61,21.59 | v78.42,41.91 v78.42,26.04
  Bottom 0.254: v78.42,26.04 78.42,25.4 v74.61,21.59 | v78.42,41.91 11.11,41.91 ARDUINO_NANO1.30
MOSI  (via drill 0.3)
  Top 0.254: v63.82,24.77 62.55,23.5 IC5.3 | v2.86,28.57 2.86,42.55 7.3,46.99 ARDUINO_NANO1.29
  Bottom 0.254: v63.82,24.77 60.01,28.57 v2.86,28.57
NA13  (via drill 0.3)
  Top 0.254: v25.08,40.01 22.54,37.47 ARDUINO_NANO1.8 | v90.49,40.64 97.47,47.62 IC4.26
  Bottom 0.254: v25.08,40.01 25.72,40.64 v90.49,40.64
ND0  (via drill 0.3)
  Top 0.254: IC2.2 IC1.19 v29.53,24.77 | v12.38,26.67 ARDUINO_NANO1.4
  Bottom 0.254: v12.38,26.67 14.29,24.77 v29.53,24.77
ND1  (via drill 0.3)
  Top 0.254: IC2.3 IC1.18 29.53,23.5 28.89,24.13 28.89,25.08 29.21,25.4 32.7,25.4 33.02,25.72 33.02,26.35 v30.16,29.21
  Bottom 0.254: ARDUINO_NANO1.5 14.92,31.75 17.46,29.21 v30.16,29.21
ND2  (via drill 0.3)
  Top 0.254: IC2.4 IC1.17 v29.53,22.23 | ARDUINO_NANO1.6 23.81,26.67 v23.81,22.23
  Bottom 0.254: v29.53,22.23 v23.81,22.23
ND3
  Top 0.254: IC2.5 IC1.16 29.53,20.95 26.35,24.13 26.35,30.48 25.72,31.11 22.54,31.11 20.64,33.02 ARDUINO_NANO1.7
ND4
  Top 0.254: IC1.15 IC2.6 42.86,19.68 44.13,20.95 44.13,25.4 39.05,30.48 38.42,30.48 36.51,32.38 36.51,40.01 28.89,47.62 28.89,48.9 28.26,49.53 25.72,49.53 25.08,48.9 ARDUINO_NANO1.22
ND5  (via drill 0.3)
  Top 0.254: IC2.7 IC1.14 30.8,18.41 29.85,19.37 29.85,20 30.16,20.32 42.86,20.32 43.5,20.95 43.5,24.77 42.86,25.4 39.69,25.4 36.51,28.57 v36.51,31.11 | ARDUINO_NANO1.23 28.89,41.91 v28.89,31.75
  Bottom 0.254: v28.89,31.75 29.53,31.11 v36.51,31.11
ND6  (via drill 0.3)
  Top 0.254: 30.16,17.14 29.53,17.14 v28.26,18.41 | 30.16,17.14 IC1.13 | v43.5,19.05 43.5,18.41 42.23,17.14 IC2.8 | ARDUINO_NANO1.24 20,48.9 18.73,50.16 12.38,50.16 11.11,48.9 11.11,47.62 3.49,40.01 v3.49,26.67 | 30.16,17.14 v28.26,15.24
  Bottom 0.254: v28.26,18.41 28.89,19.05 v43.5,19.05 | v3.49,26.67 13.65,16.51 21.91,16.51 23.18,15.24 v28.26,15.24
ND7  (via drill 0.3)
  Top 0.254: IC2.9 33.65,15.88 | 33.65,15.88 IC1.12 | ARDUINO_NANO1.25 17.46,48.9 16.83,49.53 14.29,49.53 13.65,48.9 13.65,47.62 11.11,45.09 v11.11,26.67 | 33.65,15.88 v33.65,17.78
  Bottom 0.254: v11.11,26.67 11.11,24.77 16.83,19.05 26.35,19.05 27.62,17.78 v33.65,17.78
SCK  (via drill 0.3)
  Top 0.254: v60.01,22.23 IC5.4 | v16.19,29.21 v17.46,27.94
  Bottom 0.254: v17.46,27.94 55.88,27.94 60.01,23.81 v60.01,22.23 | v16.19,29.21 13.65,31.75 6.03,31.75 ARDUINO_NANO1.1
SD-MISO  (via drill 0.3)
  Top 0.254: v72.07,27.3 72.07,36.2 72.07,37.78 72.08,37.79 J1.7 | v63.82,22.23 62.55,20.95 IC5.5
  Bottom 0.254: v72.07,27.3 72.07,23.5 70.8,22.23 v63.82,22.23
SD-MOSI  (via drill 0.3)
  Top 0.254: v67.63,33.02 67.63,36.2 67.63,37.78 67.68,37.83 J1.3 | v70.17,27.3 v70.17,33.02 | v70.17,22.86 70.8,22.86 71.44,22.23 IC5.17
  Bottom 0.254: v70.17,33.02 v67.63,33.02 | v70.17,22.86 v70.17,27.3
SD-SCK  (via drill 0.3)
  Top 0.254: v75.88,24.13 73.34,26.67 71.44,26.67 71.44,34.29 69.85,35.88 69.85,37.78 69.88,37.81 J1.5 | v73.98,22.23 72.71,20.95 IC5.16
  Bottom 0.254: v73.98,22.23 v75.88,24.13
SLOT_N_RD
  Top 0.254: IC3.8 10.48,17.78 10.48,19.05 IC3.9 9.84,19.05 7.3,21.59 7.3,30.48 6.99,30.8 5.08,30.8 4.76,30.48 4.76,25.4 IC3.1 3.49,25.4 2.22,26.67 2.22,43.81 6.03,47.62 6.03,48.9 7.94,50.8 28.26,50.8 30.16,48.9 ARDUINO_NANO1.20
SLOT_N_WR  (via drill 0.3)
  Top 0.254: IC1.11 27.62,14.61 25.72,16.51 v25.72,27.3 | v33.34,27.3 33.34,29.21 33.97,29.84 33.97,40.64 27.62,46.99 ARDUINO_NANO1.21 | IC3.4 3.49,21.59 v2.86,22.23
  Bottom 0.254: v33.34,27.3 v25.72,27.3 16.83,27.3 16.19,27.94 3.49,27.94 2.86,27.3 v2.86,22.23
TVCIN_CLK  (via drill 0.3)
  Top 0.254: IC2.11 53.02,14.61 v53.66,15.24
  Bottom 0.254: v53.66,15.24 54.93,16.51 84.77,16.51 94.3,26.04 96.2,26.04 98.74,28.57 119.7,28.57 120.97,29.84 120.97,30.48 120.33,31.11 117.79,31.11 116.52,32.38 116.52,34.29 108.27,42.55 18.1,42.55 ARDUINO_NANO1.27

### Text on the board
tPlace: Videoton TV-Computer / NanoSD IO Card | rev 2
bPlace: by Sanyi / 2021